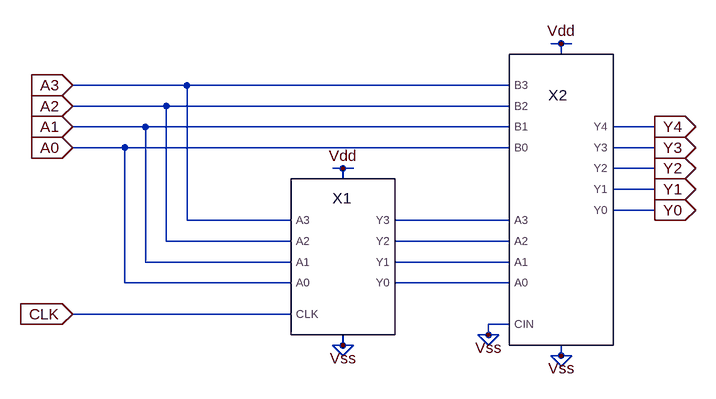
[diagram p0: schematic 4bitavg.asc]
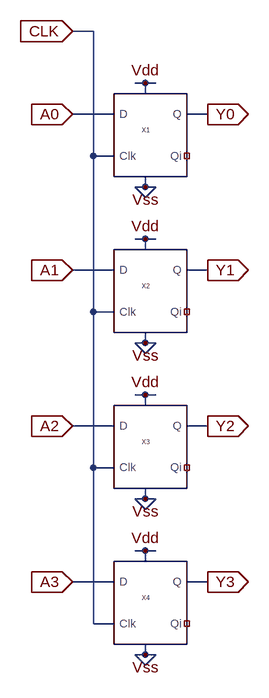
[diagram p1: sub-circuit 4bitreg.asc]
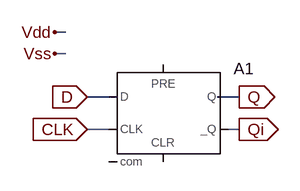
[diagram p2: sub-circuit dff.asc]
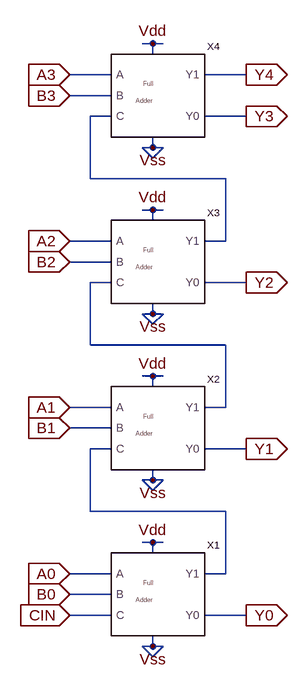
[diagram p3: sub-circuit 4bitadder.asc]
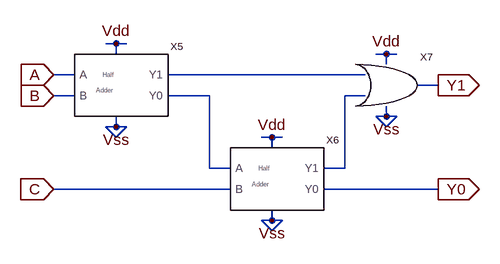
[diagram p4: sub-circuit fulladder.asc]
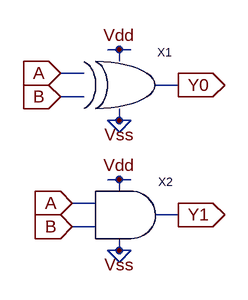
[diagram p5: sub-circuit halfadder.asc]
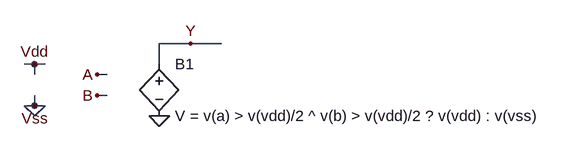
[diagram p6: sub-circuit xor.asc]
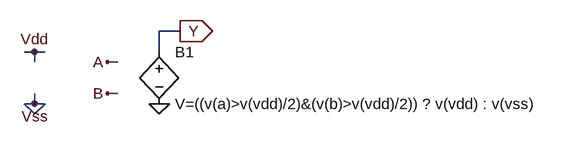
[diagram p7: sub-circuit and.asc]
4bitavg.asc, the LTspice schematic file:
Version 4
SHEET 1 880 680
WIRE 96 -80 80 -80
WIRE 112 -80 96 -80
WIRE 96 -64 96 -80
WIRE -480 -16 -656 -16
WIRE 16 -16 -480 -16
WIRE -512 16 -656 16
WIRE 16 16 -512 16
WIRE -544 48 -656 48
WIRE 16 48 -544 48
WIRE 240 48 176 48
WIRE -576 80 -656 80
WIRE 16 80 -576 80
WIRE 240 80 176 80
WIRE -240 112 -256 112
WIRE -224 112 -240 112
WIRE 240 112 176 112
WIRE -240 128 -240 112
WIRE 240 144 176 144
WIRE 240 176 176 176
WIRE -480 192 -480 -16
WIRE -320 192 -480 192
WIRE 16 192 -160 192
WIRE -512 224 -512 16
WIRE -320 224 -512 224
WIRE 16 224 -160 224
WIRE -544 256 -544 48
WIRE -320 256 -544 256
WIRE 16 256 -160 256
WIRE -576 288 -576 80
WIRE -320 288 -576 288
WIRE 16 288 -160 288
WIRE -320 336 -656 336
WIRE 16 352 -16 352
WIRE -16 368 -16 352
WIRE -16 368 -32 368
WIRE 0 368 -16 368
WIRE -240 384 -240 368
WIRE -240 384 -256 384
WIRE -224 384 -240 384
WIRE -16 384 -32 368
WIRE -16 384 0 368
WIRE -240 400 -256 384
WIRE -240 400 -224 384
WIRE 96 400 96 384
WIRE 96 400 80 400
WIRE 112 400 96 400
WIRE 96 416 80 400
WIRE 96 416 112 400
FLAG 96 -80 Vdd
FLAG 96 400 Vss
FLAG 240 176 Y0
IOPIN 240 176 Out
FLAG 240 144 Y1
IOPIN 240 144 Out
FLAG 240 112 Y2
IOPIN 240 112 Out
FLAG 240 80 Y3
IOPIN 240 80 Out
FLAG 240 48 Y4
IOPIN 240 48 Out
FLAG -16 368 Vss
FLAG -656 80 A0
IOPIN -656 80 In
FLAG -656 48 A1
IOPIN -656 48 In
FLAG -656 16 A2
IOPIN -656 16 In
FLAG -656 -16 A3
IOPIN -656 -16 In
FLAG -656 336 CLK
IOPIN -656 336 In
FLAG -240 384 Vss
FLAG -240 112 Vdd
SYMBOL 4bitreg -320 368 R0
WINDOW 0 64 -210 Left 0
SYMATTR InstName X1
SYMBOL 4bitadder 16 384 R0
WINDOW 0 60 -385 Left 0
SYMATTR InstName X2

4bitreg.asc, the sub-circuit schematic file:
Version 4
SHEET 1 880 1012
WIRE -192 -224 -224 -224
WIRE -112 -144 -128 -144
WIRE -96 -144 -112 -144
WIRE -112 -128 -112 -144
WIRE -160 -96 -224 -96
WIRE -16 -96 -48 -96
WIRE -192 -32 -192 -224
WIRE -160 -32 -192 -32
WIRE -112 16 -112 0
WIRE -112 16 -128 16
WIRE -96 16 -112 16
WIRE -112 32 -128 16
WIRE -112 32 -96 16
WIRE -112 96 -128 96
WIRE -96 96 -112 96
WIRE -112 112 -112 96
WIRE -160 144 -224 144
WIRE -16 144 -48 144
WIRE -192 208 -192 -32
WIRE -160 208 -192 208
WIRE -112 256 -112 240
WIRE -112 256 -128 256
WIRE -96 256 -112 256
WIRE -112 272 -128 256
WIRE -112 272 -96 256
WIRE -112 336 -128 336
WIRE -96 336 -112 336
WIRE -112 352 -112 336
WIRE -160 384 -224 384
WIRE -16 384 -48 384
WIRE -192 448 -192 208
WIRE -160 448 -192 448
WIRE -112 496 -112 480
WIRE -112 496 -128 496
WIRE -96 496 -112 496
WIRE -112 512 -128 496
WIRE -112 512 -96 496
WIRE -112 576 -128 576
WIRE -96 576 -112 576
WIRE -112 592 -112 576
WIRE -160 624 -224 624
WIRE -16 624 -48 624
WIRE -192 688 -192 448
WIRE -160 688 -192 688
WIRE -112 736 -112 720
WIRE -112 736 -128 736
WIRE -96 736 -112 736
WIRE -112 752 -128 736
WIRE -112 752 -96 736
FLAG -112 -144 Vdd
FLAG -112 16 Vss
FLAG -224 -96 A0
IOPIN -224 -96 In
FLAG -16 -96 Y0
IOPIN -16 -96 Out
FLAG -112 96 Vdd
FLAG -112 256 Vss
FLAG -224 144 A1
IOPIN -224 144 In
FLAG -16 144 Y1
IOPIN -16 144 Out
FLAG -112 336 Vdd
FLAG -112 496 Vss
FLAG -224 384 A2
IOPIN -224 384 In
FLAG -16 384 Y2
IOPIN -16 384 Out
FLAG -112 576 Vdd
FLAG -112 736 Vss
FLAG -224 624 A3
IOPIN -224 624 In
FLAG -16 624 Y3
IOPIN -16 624 Out
FLAG -224 -224 CLK
IOPIN -224 -224 In
SYMBOL dff -160 0 R0
SYMATTR InstName X1
SYMBOL dff -160 240 R0
SYMATTR InstName X2
SYMBOL dff -160 480 R0
SYMATTR InstName X3
SYMBOL dff -160 720 R0
SYMATTR InstName X4

dff.asc, the sub-circuit schematic file:
Version 4
SHEET 1 880 680
WIRE 64 32 48 32
WIRE 64 64 48 64
WIRE 128 128 96 128
WIRE 320 128 288 128
WIRE 128 176 96 176
WIRE 320 176 304 176
FLAG 96 128 D
IOPIN 96 128 In
FLAG 96 176 CLK
IOPIN 96 176 In
FLAG 320 128 Q
IOPIN 320 128 Out
FLAG 320 176 Qi
IOPIN 320 176 Out
FLAG 48 32 Vdd
FLAG 48 64 Vss
SYMBOL Digital\\dflop 208 80 R0
SYMATTR InstName A1
SYMATTR SpiceLine vhigh=5 tau=1n

4bitadder.asc, the sub-circuit schematic file:
Version 4
SHEET 1 1900 1012
WIRE 1104 32 1088 32
WIRE 1120 32 1104 32
WIRE 1104 48 1104 32
WIRE 1040 80 976 80
WIRE 1248 80 1184 80
WIRE 1040 112 976 112
WIRE 1040 144 1008 144
WIRE 1248 144 1184 144
WIRE 1104 192 1104 176
WIRE 1104 192 1088 192
WIRE 1120 192 1104 192
WIRE 1104 208 1088 192
WIRE 1104 208 1120 192
WIRE 1008 240 1008 144
WIRE 1216 240 1008 240
WIRE 1104 288 1088 288
WIRE 1120 288 1104 288
WIRE 1104 304 1104 288
WIRE 1040 336 976 336
WIRE 1216 336 1216 240
WIRE 1216 336 1184 336
WIRE 1040 368 976 368
WIRE 1040 400 1008 400
WIRE 1248 400 1184 400
WIRE 1104 448 1104 432
WIRE 1104 448 1088 448
WIRE 1120 448 1104 448
WIRE 1104 464 1088 448
WIRE 1104 464 1120 448
WIRE 1008 496 1008 400
WIRE 1216 496 1008 496
WIRE 1104 544 1088 544
WIRE 1120 544 1104 544
WIRE 1104 560 1104 544
WIRE 1040 592 976 592
WIRE 1216 592 1216 496
WIRE 1216 592 1184 592
WIRE 1040 624 976 624
WIRE 1040 656 1008 656
WIRE 1248 656 1184 656
WIRE 1104 704 1104 688
WIRE 1104 704 1088 704
WIRE 1120 704 1104 704
WIRE 1104 720 1088 704
WIRE 1104 720 1120 704
WIRE 1008 752 1008 656
WIRE 1216 752 1008 752
WIRE 1104 800 1088 800
WIRE 1120 800 1104 800
WIRE 1104 816 1104 800
WIRE 1040 848 976 848
WIRE 1216 848 1216 752
WIRE 1216 848 1184 848
WIRE 1040 880 976 880
WIRE 1040 912 976 912
WIRE 1248 912 1184 912
WIRE 1104 960 1104 944
WIRE 1104 960 1088 960
WIRE 1120 960 1104 960
WIRE 1104 976 1088 960
WIRE 1104 976 1120 960
FLAG 976 848 A0
IOPIN 976 848 In
FLAG 976 880 B0
IOPIN 976 880 In
FLAG 1104 800 Vdd
FLAG 1104 960 Vss
FLAG 976 592 A1
IOPIN 976 592 In
FLAG 976 624 B1
IOPIN 976 624 In
FLAG 1104 544 Vdd
FLAG 1104 704 Vss
FLAG 976 336 A2
IOPIN 976 336 In
FLAG 976 368 B2
IOPIN 976 368 In
FLAG 1104 288 Vdd
FLAG 1104 448 Vss
FLAG 976 80 A3
IOPIN 976 80 In
FLAG 976 112 B3
IOPIN 976 112 In
FLAG 1104 32 Vdd
FLAG 1104 192 Vss
FLAG 976 912 CIN
IOPIN 976 912 In
FLAG 1248 912 Y0
IOPIN 1248 912 Out
FLAG 1248 656 Y1
IOPIN 1248 656 Out
FLAG 1248 400 Y2
IOPIN 1248 400 Out
FLAG 1248 144 Y3
IOPIN 1248 144 Out
FLAG 1248 80 Y4
IOPIN 1248 80 Out
SYMBOL fulladder 1040 944 R0
SYMATTR InstName X1
SYMBOL fulladder 1040 688 R0
SYMATTR InstName X2
SYMBOL fulladder 1040 432 R0
SYMATTR InstName X3
SYMBOL fulladder 1040 176 R0
SYMATTR InstName X4

fulladder.asc, the sub-circuit schematic file:
Version 4
SHEET 1 1124 956
WIRE 112 64 96 64
WIRE 128 64 112 64
WIRE 112 80 112 64
WIRE 528 80 512 80
WIRE 544 80 528 80
WIRE 528 96 528 80
WIRE 48 112 16 112
WIRE 496 112 192 112
WIRE 608 128 576 128
WIRE 48 144 16 144
WIRE 256 144 192 144
WIRE 496 144 464 144
WIRE 528 176 528 160
WIRE 528 176 512 176
WIRE 544 176 528 176
WIRE 112 192 112 176
WIRE 112 192 96 192
WIRE 128 192 112 192
WIRE 528 192 512 176
WIRE 528 192 544 176
WIRE 112 208 96 192
WIRE 112 208 128 192
WIRE 352 208 336 208
WIRE 368 208 352 208
WIRE 352 224 352 208
WIRE 256 256 256 144
WIRE 288 256 256 256
WIRE 464 256 464 144
WIRE 464 256 432 256
WIRE 288 288 16 288
WIRE 608 288 432 288
WIRE 352 336 352 320
WIRE 352 336 336 336
WIRE 368 336 352 336
WIRE 352 352 336 336
WIRE 352 352 368 336
FLAG 112 64 Vdd
FLAG 112 192 Vss
FLAG 352 208 Vdd
FLAG 352 336 Vss
FLAG 608 288 Y0
IOPIN 608 288 Out
FLAG 16 112 A
IOPIN 16 112 In
FLAG 16 144 B
IOPIN 16 144 In
FLAG 16 288 C
IOPIN 16 288 In
FLAG 528 80 Vdd
FLAG 528 176 Vss
FLAG 608 128 Y1
IOPIN 608 128 Out
SYMBOL HalfAdder 48 176 R0
SYMATTR InstName X5
SYMBOL HalfAdder 288 320 R0
SYMATTR InstName X6
SYMBOL or 496 128 R0
SYMATTR InstName X7

halfadder.asc, the sub-circuit schematic file:
Version 4
SHEET 1 880 680
WIRE 96 240 80 240
WIRE 112 240 96 240
WIRE 96 256 96 240
WIRE 48 272 16 272
WIRE 176 288 144 288
WIRE 48 304 16 304
WIRE 96 336 96 320
WIRE 96 336 80 336
WIRE 112 336 96 336
WIRE 96 352 80 336
WIRE 96 352 112 336
WIRE 96 416 80 416
WIRE 112 416 96 416
WIRE 96 432 96 416
WIRE 64 448 32 448
WIRE 176 464 144 464
WIRE 64 480 32 480
WIRE 96 512 96 496
WIRE 96 512 80 512
WIRE 112 512 96 512
WIRE 96 528 80 512
WIRE 96 528 112 512
FLAG 16 272 A
IOPIN 16 272 In
FLAG 16 304 B
IOPIN 16 304 In
FLAG 176 288 Y0
IOPIN 176 288 Out
FLAG 96 240 Vdd
FLAG 96 336 Vss
FLAG 96 416 Vdd
FLAG 96 512 Vss
FLAG 32 448 A
IOPIN 32 448 In
FLAG 32 480 B
IOPIN 32 480 In
FLAG 176 464 Y1
IOPIN 176 464 Out
SYMBOL xor 48 288 R0
SYMATTR InstName X1
SYMBOL and 64 464 R0
SYMATTR InstName X2

xor.asc, the sub-circuit schematic file:
Version 4
SHEET 1 1264 952
WIRE 592 448 544 448
WIRE 640 448 592 448
WIRE 352 480 336 480
WIRE 368 480 352 480
WIRE 544 480 544 448
WIRE 352 496 352 480
WIRE 464 496 448 496
WIRE 464 528 448 528
WIRE 352 544 352 528
WIRE 352 544 336 544
WIRE 368 544 352 544
WIRE 352 560 336 544
WIRE 352 560 368 544
FLAG 448 496 A
FLAG 448 528 B
FLAG 352 480 Vdd
FLAG 352 544 Vss
FLAG 544 560 0
FLAG 592 448 Y
SYMBOL bv 544 464 R0
SYMATTR InstName B1
SYMATTR Value V = v(a) > v(vdd)/2 ^ v(b) > v(vdd)/2 ? v(vdd) : v(vss)

and.asc, the sub-circuit schematic file:
Version 4
SHEET 1 1192 680
WIRE 560 80 528 80
WIRE 336 112 320 112
WIRE 352 112 336 112
WIRE 528 112 528 80
WIRE 336 128 336 112
WIRE 464 128 448 128
WIRE 464 176 448 176
WIRE 336 192 336 176
WIRE 336 192 320 192
WIRE 352 192 336 192
WIRE 336 208 320 192
WIRE 336 208 352 192
FLAG 448 128 A
FLAG 448 176 B
FLAG 336 112 Vdd
FLAG 560 80 Y
IOPIN 560 80 Out
FLAG 336 192 Vss
FLAG 528 192 0
SYMBOL bv 528 96 R0
SYMATTR InstName B1
SYMATTR Value V=((v(a)>v(vdd)/2)&(v(b)>v(vdd)/2)) ? v(vdd) : v(vss)

or.asc, the sub-circuit schematic file:
Version 4
SHEET 1 1284 680
WIRE 656 0 640 0
WIRE 656 32 640 32
WIRE 656 112 624 112
WIRE 496 144 480 144
WIRE 512 144 496 144
WIRE 624 144 624 112
WIRE 496 160 496 144
WIRE 496 192 496 176
WIRE 496 192 480 192
WIRE 512 192 496 192
WIRE 496 208 480 192
WIRE 496 208 512 192
FLAG 656 112 Y
IOPIN 656 112 Out
FLAG 624 224 0
FLAG 640 0 A
IOPIN 640 0 In
FLAG 640 32 B
IOPIN 640 32 In
FLAG 496 144 Vdd
FLAG 496 192 Vss
SYMBOL bv 624 128 R0
SYMATTR InstName B1
SYMATTR Value V=v(a)>v(vdd)/2 | v(b)>v(vdd)/2 ? v(vdd) : v(vss)

The netlist it stands for:
* 4bitavg.asc
XX1 Vdd Vss CLK A0 A1 A2 A3 N004 N003 N002 N001 4bitreg
XX2 Vdd Vss Vss N004 N003 N002 N001 A0 A1 A2 A3 Y0 Y1 Y2 Y3 Y4 4bitadder

* block symbol definitions
.subckt 4bitreg Vdd Vss CLK A0 A1 A2 A3 Y0 Y1 Y2 Y3
XX1 A0 CLK Y0 NC_01 Vdd Vss dff
XX2 A1 CLK Y1 NC_02 Vdd Vss dff
XX3 A2 CLK Y2 NC_03 Vdd Vss dff
XX4 A3 CLK Y3 NC_04 Vdd Vss dff
.ends 4bitreg

.subckt dff D Clk Q Qi VDD Vss
A1 D 0 CLK 0 0 Qi Q 0 DFLOP vhigh=5 tau=1n
.ends dff

.subckt 4bitadder Vdd Vss CIN A0 A1 A2 A3 B0 B1 B2 B3 Y0 Y1 Y2 Y3 Y4
XX1 A0 B0 Y0 N003 Vdd Vss CIN fulladder
XX2 A1 B1 Y1 N002 Vdd Vss N003 fulladder
XX3 A2 B2 Y2 N001 Vdd Vss N002 fulladder
XX4 A3 B3 Y3 Y4 Vdd Vss N001 fulladder
.ends 4bitadder

.subckt fulladder A B Y0 Y1 Vdd Vss C
XX5 A B N002 N001 Vdd Vss halfadder
XX6 N002 C Y0 N003 Vdd Vss halfadder
XX7 N001 N003 Y1 Vdd Vss or
.ends fulladder

.subckt halfadder A B Y0 Y1 Vdd Vss
XX1 A B Y0 Vdd Vss xor
XX2 A B Y1 Vdd Vss and
.ends halfadder

.subckt xor A B Y Vdd Vss
B1 Y 0 V = v(a) > v(vdd)/2 ^ v(b) > v(vdd)/2 ? v(vdd) : v(vss)
.ends xor

.subckt and A B Y Vdd Vss
B1 Y 0 V=((v(a)>v(vdd)/2)&(v(b)>v(vdd)/2)) ? v(vdd) : v(vss)
.ends and

.subckt or A B Y Vdd Vss
B1 Y 0 V=v(a)>v(vdd)/2 | v(b)>v(vdd)/2 ? v(vdd) : v(vss)
.ends or

.backanno
.end